# EAGLE design BusCon (EAGLE 4.11)
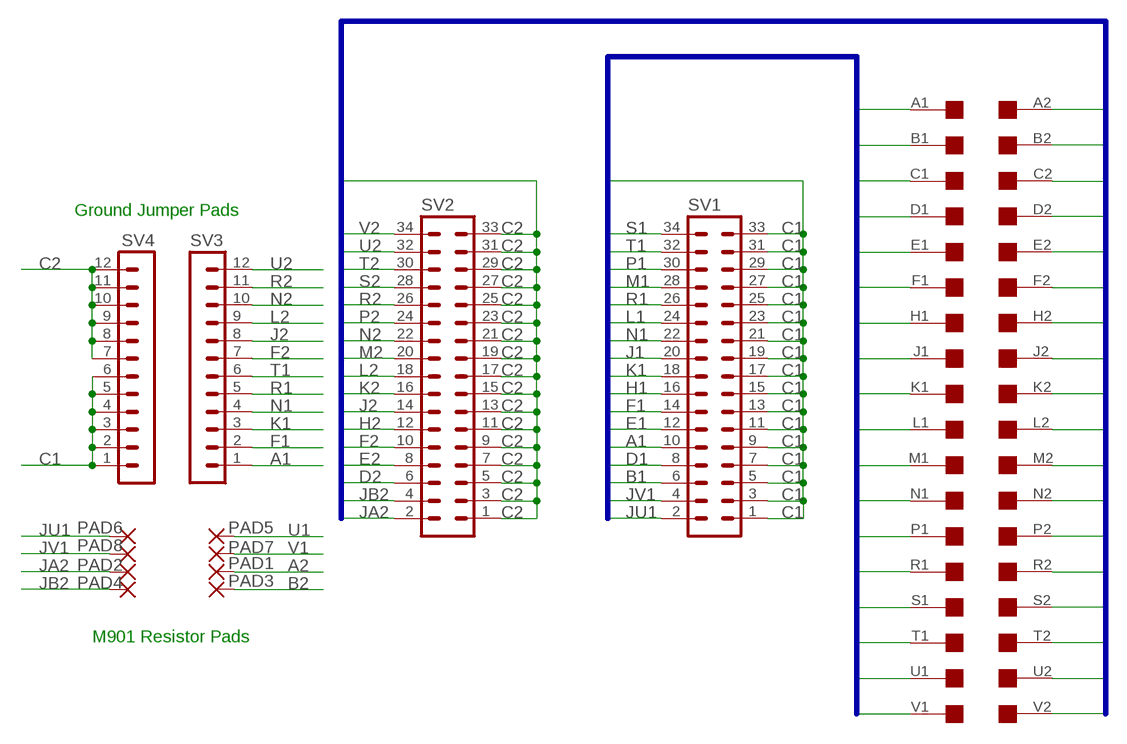
[diagram p0: schematic, sheet 1]

## Parts
PAD1  1,6/0,8  [1,6/0,8]
PAD2  1,6/0,8  [1,6/0,8]
PAD3  1,6/0,8  [1,6/0,8]
PAD4  1,6/0,8  [1,6/0,8]
PAD5  1,6/0,8  [1,6/0,8]
PAD6  1,6/0,8  [1,6/0,8]
PAD7  1,6/0,8  [1,6/0,8]
PAD8  1,6/0,8  [1,6/0,8]
SV1  MA17-2  [MA17-2]
SV2  MA17-2  [MA17-2]
SV3  MA12-1  [MA12-1]
SV4  MA12-1  [MA12-1]
U$1  DEC-FLIPCHIP  [DEC-FLIPCHIP]

## Nets
A1: SV1.10 SV3.1 U$1.A1
A2: PAD1.1(P) U$1.A2
B1: SV1.6 U$1.B1
B2: PAD3.1(P) U$1.B2
C1: SV1.1 SV1.3 SV1.5 SV1.7 SV1.9 SV1.11 SV1.13 SV1.15 SV1.17 SV1.19 SV1.21 SV1.23 SV1.25 SV1.27 SV1.29 SV1.31 SV1.33 SV4.1 SV4.2 SV4.3 SV4.4 SV4.5 SV4.6 U$1.C1
C2: SV2.1 SV2.3 SV2.5 SV2.7 SV2.9 SV2.11 SV2.13 SV2.15 SV2.17 SV2.19 SV2.21 SV2.23 SV2.25 SV2.27 SV2.29 SV2.31 SV2.33 SV4.7 SV4.8 SV4.9 SV4.10 SV4.11 SV4.12 U$1.C2
D1: SV1.8 U$1.D1
D2: SV2.6 U$1.D2
E1: SV1.12 U$1.E1
E2: SV2.8 U$1.E2
F1: SV1.14 SV3.2 U$1.F1
F2: SV2.10 SV3.7 U$1.F2
H1: SV1.16 U$1.H1
H2: SV2.12 U$1.H2
J1: SV1.20 U$1.J1
J2: SV2.14 SV3.8 U$1.J2
JA2: PAD2.1(P) SV2.2
JB2: PAD4.1(P) SV2.4
JU1: PAD6.1(P) SV1.2
JV1: PAD8.1(P) SV1.4
K1: SV1.18 SV3.3 U$1.K1
K2: SV2.16 U$1.K2
L1: SV1.24 U$1.L1
L2: SV2.18 SV3.9 U$1.L2
M1: SV1.28 U$1.M1
M2: SV2.20 U$1.M2
N1: SV1.22 SV3.4 U$1.N1
N2: SV2.22 SV3.10 U$1.N2
P1: SV1.30 U$1.P1
P2: SV2.24 U$1.P2
R1: SV1.26 SV3.5 U$1.R1
R2: SV2.26 SV3.11 U$1.R2
S1: SV1.34 U$1.S1
S2: SV2.28 U$1.S2
T1: SV1.32 SV3.6 U$1.T1
T2: SV2.30 U$1.T2
U1: PAD5.1(P) U$1.U1
U2: SV2.32 SV3.12 U$1.U2
V1: PAD7.1(P) U$1.V1
V2: SV2.34 U$1.V2

## Buses
A1,B1,C1,D1,E1,F1,H1,J1,K1,L1,M1,N1,P1,R1,S1,T1,U1,V1
A2,B2,C2,D2,E2,F2,H2,J2,K2,L2,M2,N2,P2,R2,S2,T2,U2,V2

## Notes on the sheet
- Ground Jumper Pads
- M901 Resistor Pads

## Library data of the parts
PAD1-PAD8 = wirepad:1,6/0,8: THROUGH-HOLE PAD
SV1 SV2 = con-lstb:MA17-2: PIN HEADER
SV3 SV4 = con-lstb:MA12-1: PIN HEADER
U$1 = con-dec:DEC-FLIPCHIP: DEC Flip-Chip single card fingers

## Board
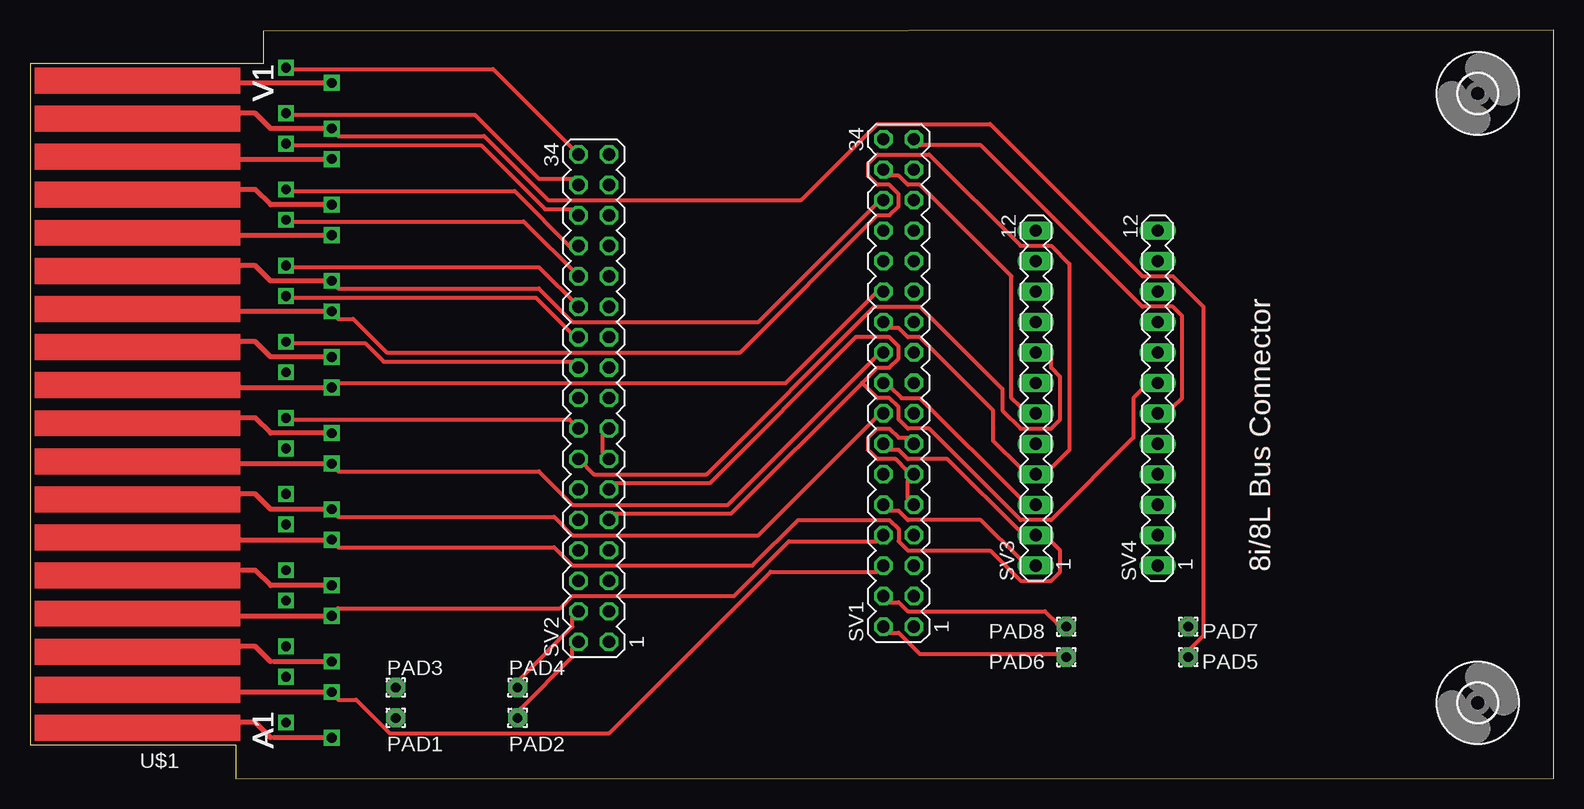
[diagram p1: board, top side]
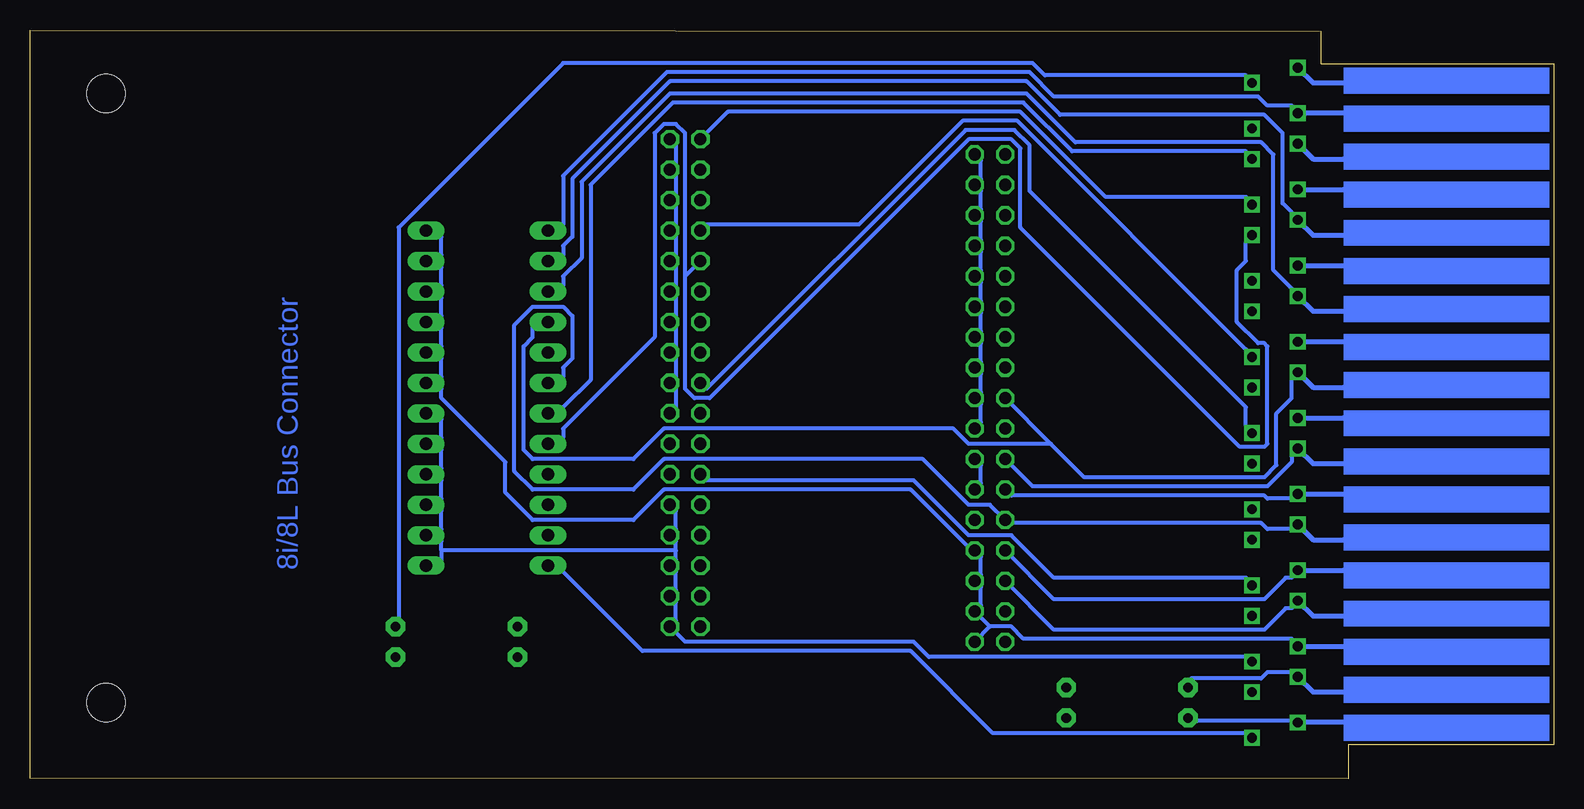
[diagram p2: board, bottom side, seen from below]

Size 126.98 x 62.45 mm. Coordinates in mm from the lower left corner, seen from the top.
Outline: 0,2.83 17.14,2.83 17.14,0 126.98,0.04 126.98,62.45 19.43,62.36 19.43,59.65 0,59.65 0,2.83
Copper layers (1*16): Top 0.035mm / dielectric 1.5mm / Bottom 0.035mm
Design rules "10mils": minimum track width 13mil, minimum drill 28mil, track to track 10mil, track to pad 10mil, pad to pad 10mil, via to via 10mil, smd to smd 10mil, copper to edge 40mil, drill to drill 10mil, minimum pad ring 10mil, minimum via ring 8mil, stop-mask expansion 0mil, vias tented up to drill 0mil, thermal gap 10mil

### Footprints (pad centres in the part's own frame; a part is rotated, then mirrored left to right if it is on the bottom)
1,6/0,8 = drill 0.813 pad 1.6 octagon: 1 0,0
MA17-2 = drill 1.016 octagon: 1 -20.32,-1.27; 2 -20.32,1.27; 3 -17.78,-1.27; 4 -17.78,1.27; 5 -15.24,-1.27; 6 -15.24,1.27; 7 -12.7,-1.27; 8 -12.7,1.27; 9 -10.16,-1.27; 10 -10.16,1.27; 11 -7.62,-1.27; 12 -7.62,1.27; 13 -5.08,-1.27; 14 -5.08,1.27; 15 -2.54,-1.27; 16 -2.54,1.27; 17 0,-1.27; 18 0,1.27; 19 2.54,-1.27; 20 2.54,1.27; 21 5.08,-1.27; 22 5.08,1.27; 23 7.62,-1.27; 24 7.62,1.27; 25 10.16,-1.27; 26 10.16,1.27; 27 12.7,-1.27; 28 12.7,1.27; 29 15.24,-1.27; 30 15.24,1.27; 31 17.78,-1.27; 32 17.78,1.27; 33 20.32,-1.27; 34 20.32,1.27
MA12-1 = drill 1.016 long: 1 -13.97,0; 2 -11.43,0; 3 -8.89,0; 4 -6.35,0; 5 -3.81,0; 6 -1.27,0; 7 1.27,0; 8 3.81,0; 9 6.35,0; 10 8.89,0; 11 11.43,0; 12 13.97,0
DEC-FLIPCHIP = drill 0.813 square: A1 -7.62,27.94; A2 -3.81,26.67; B1 -7.62,24.13; B2 -3.81,22.86; C1 -7.62,21.59; C2 -3.81,20.32; D1 -7.62,17.78; D2 -3.81,16.51; E1 -7.62,15.24; E2 -3.81,13.97; F1 -7.62,11.43; F2 -3.81,10.16; H1 -7.62,8.89; H2 -3.81,7.62; J1 -7.62,5.08; J2 -3.81,3.81; K1 -7.62,2.54; K2 -3.81,1.27; L1 -7.62,-1.27; L2 -3.81,-2.54; M1 -7.62,-3.81; M2 -3.81,-5.08; N1 -7.62,-7.62; N2 -3.81,-8.89; P1 -7.62,-10.16; P2 -3.81,-11.43; R1 -7.62,-13.97; R2 -3.81,-15.24; S1 -7.62,-16.51; S2 -3.81,-17.78; T1 -7.62,-20.32; T2 -3.81,-21.59; U1 -7.62,-22.86; U2 -3.81,-24.13; V1 -7.62,-26.67; V2 -3.81,-27.94
3,2 = hole 3.2: 0,0

### Placement (x,y rotation side)
PAD1  30.48,5.08 0 top
PAD2  40.63,5.08 0 top
PAD3  30.48,7.62 0 top
PAD4  40.63,7.62 0 top
PAD5  96.52,10.16 180 top
PAD6  86.36,10.16 180 top
PAD7  96.52,12.7 180 top
PAD8  86.36,12.7 180 top
SV1  72.39,33.02 90 top
SV2  46.98,31.75 90 top
SV3  83.81,31.75 90 top
SV4  93.98,31.75 90 top
U$1  17.52,31.37 180 top
U$2  [3,2]  120.65,6.35 0 top
U$3  [3,2]  120.65,57.15 0 top

### Tracks (layer width: path | path; a pad name or v marks a point on that pad's centre or on a via)
A1
  Top 0.33: SV1.10 71.62,22.35 72.39,22.35 73.15,21.59 79.24,21.59 82.55,18.29 SV3.1
  Bottom 0.33: U$1.A1 25.65,3.81 46.73,3.81 53.59,10.67 75.94,10.67 82.55,17.27 SV3.1
A2
  Bottom 0.33: U$1.A2 21.84,4.83 29.71,4.83 PAD1.1
B1
  Top 0.33: U$1.B1 25.65,6.6 27.17,6.6 29.97,3.81 48.25,3.81 61.72,17.27 70.61,17.27 SV1.6
B2
  Bottom 0.33: U$1.B2 21.84,8.89 23.87,8.89 24.38,8.38 30.22,8.38 PAD3.1
C1
  Top 0.33: SV1.9 73.15,23.37 73.15,24.89 SV1.11 73.15,25.65 72.13,26.67 70.61,26.67 69.84,27.43 69.84,28.45 70.61,29.21 71.62,29.21 72.39,28.45 73.15,28.45 SV1.13 | SV1.33 74.16,52.83 79.24,52.83 92.7,39.37 95.25,39.37 96.01,38.61 96.01,31.75 95.25,30.99 SV4.6
  Bottom 0.33: SV1.15 73.15,30.99 73.15,32.51 SV1.17 73.15,33.53 73.15,35.05 SV1.19 73.15,36.07 73.15,37.59 SV1.21 73.15,38.61 73.15,40.13 SV1.23 73.15,41.15 73.15,42.67 SV1.25 73.15,43.69 73.15,45.21 SV1.27 73.15,46.23 73.15,47.75 SV1.29 73.15,48.77 73.15,50.29 SV1.31 73.15,51.31 73.15,52.83 SV1.33 | 92.7,19.05 92.7,19.81 SV4.2 92.7,20.83 92.7,22.35 SV4.3 92.7,23.37 92.7,24.89 SV4.4 92.7,25.91 92.7,27.43 SV4.5 92.7,28.45 92.7,29.97 SV4.6 | 92.7,19.05 92.7,18.29 SV4.1 | U$1.C1 25.65,10.16 52.06,10.16 53.34,11.43 72.39,11.43 SV1.1 73.15,13.21 73.15,14.73 SV1.3 73.15,15.75 73.15,17.27 SV1.5 73.15,18.29 73.15,19.05 | 73.15,19.05 73.15,19.81 SV1.7 73.15,20.83 73.15,22.35 SV1.9 | 73.15,19.05 92.7,19.05
C2
  Top 0.33: 69.34,33.02 70.61,34.29 71.62,34.29 72.39,35.05 72.39,36.07 71.62,36.83 68.83,36.83 56.64,24.64 48.76,24.64 SV2.11 | 69.34,33.02 58.41,22.1 48.76,22.1 SV2.9 | SV2.15 47.75,28.7 47.75,27.18 SV2.13 | 69.34,33.02 70.61,31.75 71.62,31.75 72.39,30.99 72.39,29.97 73.15,29.21 74.93,29.21 82.55,21.59 85.09,21.59 91.94,28.45 91.94,31.75 92.7,32.51 SV4.7
  Bottom 0.33: SV2.15 47.75,29.72 47.75,31.24 SV2.17 47.75,32.26 47.75,33.78 SV2.19 47.75,34.8 47.75,36.32 SV2.21 47.75,37.34 47.75,38.86 SV2.23 47.75,39.88 47.75,41.4 SV2.25 47.75,42.42 47.75,43.94 SV2.27 47.75,44.96 47.75,46.48 SV2.29 47.75,47.5 47.75,49.02 SV2.31 47.75,50.04 47.75,51.56 SV2.33 | SV2.13 47.75,26.16 47.75,24.64 SV2.11 | SV4.12 92.7,45.21 92.7,43.69 SV4.11 92.7,42.67 92.7,41.15 SV4.10 92.7,40.13 92.7,38.61 SV4.9 92.7,37.59 92.7,36.07 SV4.8 92.7,35.05 92.7,33.53 SV4.7 92.7,32.51 92.7,31.75 87.37,26.42 87.37,23.88 85.09,21.59 76.7,21.59 74.16,24.13 53.59,24.13 48.76,19.3 SV2.7 47.75,18.54 47.75,17.02 SV2.5 47.75,16 47.75,14.48 SV2.3 46.98,12.7 | 46.98,12.7 45.21,12.7 44.19,11.68 21.84,11.68 U$1.C2 | 46.98,12.7 SV2.1
D1
  Top 0.33: U$1.D1 25.65,14.22 44.19,14.22 45.21,15.24 58.67,15.24 63.24,19.81 70.61,19.81 SV1.8
D2
  Bottom 0.33: U$1.D2 21.84,14.22 22.35,14.22 24.12,12.45 41.65,12.45 SV2.6
E1
  Bottom 0.33: U$1.E1 25.65,16.76 41.65,16.76 45.21,20.32 48.76,20.32 53.34,24.89 70.61,24.89 SV1.12
E2
  Bottom 0.33: U$1.E2 21.84,16.76 22.35,16.76 24.12,14.99 41.65,14.99 SV2.8
F1
  Top 0.33: U$1.F1 25.65,19.3 43.68,19.3 45.21,17.78 60.19,17.78 64,21.59 71.62,21.59 72.39,20.83 72.39,19.81 73.15,19.05 80.01,19.05 82.55,16.51 85.09,16.51 85.85,17.27 85.85,19.05 85.09,19.81 SV3.2 82.55,20.57 76.45,26.67 73.15,26.67 72.39,27.43 71.62,27.43 SV1.14
F2
  Bottom 0.33: U$1.F2 21.84,20.83 23.87,20.83 24.38,21.34 45.21,21.34 SV2.10 46.98,22.86 48.76,22.86 52.57,26.67 74.16,26.67 76.7,24.13 85.09,24.13 86.61,25.65 86.61,37.85 85.09,39.37 82.55,39.37 81.78,38.61 81.78,35.05 82.55,34.29 82.55,33.53 SV3.7
H1
  Top 0.33: U$1.H1 25.65,21.84 43.68,21.84 45.21,20.32 60.7,20.32 70.61,30.23 SV1.16
H2
  Bottom 0.33: U$1.H2 21.84,23.37 23.87,23.37 24.12,23.62 45.21,23.62 SV2.12
J1
  Top 0.33: U$1.J1 25.65,25.65 42.41,25.65 45.21,22.86 58.16,22.86 70.61,35.31 SV1.20
J2
  Top 0.33: SV3.8 85.09,35.05 85.09,34.29 85.85,33.53 85.85,29.97 85.09,29.21 82.55,29.21 81.02,30.73 81.02,32.51 74.16,39.37 70.35,39.37 56.38,25.4 46.98,25.4 SV2.14
  Bottom 0.33: U$1.J2 21.84,26.92 21.84,26.42 23.87,24.38 43.43,24.38 SV2.14
JA2
  Top 0.33: SV2.2 45.21,10.92 45.21,10.16 40.89,5.84 PAD2.1
JB2
  Top 0.33: SV2.4 45.21,13.46 45.21,12.7 40.89,8.38 PAD4.1
JU1
  Top 0.33: SV1.2 71.62,12.19 72.39,12.19 74.16,10.41 85.59,10.41 PAD6.1
JV1
  Top 0.33: SV1.4 71.62,14.73 72.39,14.73 73.15,13.97 84.58,13.97 85.59,12.95 PAD8.1
K1
  Top 0.33: SV3.3 82.55,23.37 74.16,31.75 72.64,31.75 71.62,32.77 SV1.18
  Bottom 0.33: U$1.K1 25.65,29.46 25.65,30.99 43.68,49.02 43.68,52.83 44.95,54.1 49.02,54.1 70.61,32.51 SV1.18
K2
  Top 0.33: U$1.K2 21.84,29.97 44.95,29.97 SV2.16
L1
  Top 0.33: U$1.L1 25.65,33.02 62.99,33.02 70.61,40.64 SV1.24
L2
  Bottom 0.33: 41.9,27.94 39.11,25.15 24.12,25.15 23.11,26.16 23.11,30.48 21.84,31.75 21.84,33.27 U$1.L2 | 41.9,27.94 SV2.18 | 41.9,27.94 48.76,27.94 50.03,29.21 74.16,29.21 76.7,26.67 85.09,26.67 85.85,27.43 85.85,36.07 85.09,36.83 85.09,37.59 SV3.9
M1
  Bottom 0.33: U$1.M1 25.65,35.81 44.7,54.86 49.27,54.86 57.91,46.23 70.61,46.23 SV1.28
M2
  Top 0.33: U$1.M2 21.84,36.32 27.94,36.32 29.46,34.8 45.21,34.8 SV2.20
N1
  Top 0.33: U$1.N1 25.65,38.35 26.92,38.35 29.71,35.56 59.18,35.56 70.61,46.99 71.62,46.99 72.39,47.75 72.39,48.77 71.62,49.53 70.61,49.53 69.84,50.29 69.84,51.31 70.61,52.07 74.93,52.07 82.55,44.45 85.09,44.45 86.61,42.93 86.61,27.43 85.09,25.91 SV3.4 82.55,25.91 80.26,28.19 80.26,30.73 74.16,36.83 73.15,36.83 72.39,37.59 71.62,37.59 SV1.22
N2
  Top 0.33: U$1.N2 21.84,40.13 42.16,40.13 45.21,37.08 SV2.22
  Bottom 0.33: SV3.10 82.55,41.15 82.55,41.91 81.02,43.43 81.02,49.78 73.66,57.15 43.94,57.15 39.87,53.09 24.38,53.09 23.36,52.07 23.36,42.42 21.84,40.89 U$1.N2
P1
  Top 0.33: U$1.P1 25.65,40.89 42.41,40.89 45.21,38.1 60.7,38.1 70.61,48.01 SV1.30
P2
  Top 0.33: U$1.P2 21.84,42.67 42.41,42.67 SV2.24
R1
  Bottom 0.33: 72.39,41.91 72.39,32.51 71.62,31.75 70.35,31.75 48.76,53.34 45.21,53.34 44.45,52.58 44.45,45.97 26.16,27.69 24.12,27.69 23.87,27.94 23.87,36.07 24.12,36.32 24.63,36.32 26.41,38.1 26.41,42.42 25.65,43.18 25.65,44.7 U$1.R1 | 72.39,41.91 SV1.26 | 72.39,41.91 72.39,53.85 73.15,54.61 74.16,54.61 74.93,53.85 74.93,36.83 82.55,29.21 82.55,28.45 SV3.5
R2
  Top 0.33: U$1.R2 21.84,46.48 41.14,46.48 SV2.26
  Bottom 0.33: SV3.11 82.55,43.69 82.55,44.45 81.78,45.21 81.78,50.04 73.66,58.17 43.94,58.17 41.14,55.37 24.12,55.37 22.6,53.85 22.6,48.01 21.84,47.24 U$1.R2
S1
  Bottom 0.33: U$1.S1 25.65,48.51 37.33,48.51 44.45,55.63 68.83,55.63 SV1.34
S2
  Top 0.33: U$1.S2 21.84,49.02 40.38,49.02 45.21,44.2 SV2.28
T1
  Top 0.33: SV1.32 71.62,50.29 72.39,50.29 73.15,49.53 74.16,49.53 81.78,41.91 81.78,31.75 82.55,30.99 SV3.6
  Bottom 0.33: U$1.T1 25.65,52.32 40.13,52.32 44.19,56.39 73.4,56.39 80.26,49.53 80.26,33.27 82.55,30.99 SV3.6
T2
  Top 0.33: U$1.T2 21.84,52.83 37.59,52.83 42.92,47.5 45.21,47.5 SV2.30
U1
  Top 0.33: U$1.U1 25.65,53.59 37.84,53.59 43.17,48.26 64.26,48.26 70.61,54.61 80.01,54.61 92.7,41.91 95.25,41.91 97.79,39.37 97.79,11.94 96.77,10.92 PAD5.1
U2
  Top 0.33: SV2.32 45.21,50.04 42.41,50.04 37.08,55.37 21.84,55.37 U$1.U2
  Bottom 0.33: U$1.U2 21.84,56.13 23.87,56.13 24.63,56.9 41.65,56.9 43.68,58.93 73.91,58.93 82.55,50.29 82.55,46.23 SV3.12
V1
  Bottom 0.33: U$1.V1 25.65,58.67 42.41,58.67 43.43,59.69 82.55,59.69 96.26,45.97 96.26,13.46 PAD7.1
V2
  Top 0.33: U$1.V2 21.84,59.18 38.6,59.18 SV2.34

### Text on the board
Top: 8i/8L Bus Connector
Bottom: 8i/8L Bus Connector
tPlace: 8i/8L Bus Connector
tNames: V1 | V1 | V1 | V1 | V1 | V1 | V1 | V1 | V1 | V1 | V1 | V1 | V1 | V1 | V1 | V1 | V1 | V1 | V1 | V1 | V1 | V1 | V1 | V1 | V1 | V1 | V1 | V1 | V1 | V1 | V1 | V1 | A1 | A1 | A1 | A1 | A1 | A1 | A1 | A1 | A1 | A1 | A1 | A1 | A1 | A1 | A1 | A1 | A1 | A1 | A1 | A1 | A1 | A1 | A1 | A1 | A1 | A1 | A1 | A1 | A1 | A1 | A1 | A1
tValues: Jumper unless M901 | M90x/W0x1 - always used | M901/M903/M904 - Use both | M901 | (res) | M901 | (res)